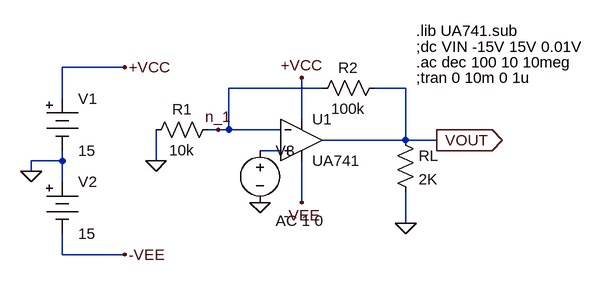
[diagram p0: schematic UA741_noninvert.asc]
UA741_noninvert.asc, the LTspice schematic file:
Version 4
SHEET 1 880 680
WIRE -96 32 -192 32
WIRE 208 64 64 64
WIRE 336 64 288 64
WIRE -192 80 -192 32
WIRE 176 112 176 48
WIRE 48 128 32 128
WIRE 64 128 64 64
WIRE 64 128 48 128
WIRE 144 128 64 128
WIRE 336 144 336 64
WIRE 336 144 208 144
WIRE 384 144 336 144
WIRE 144 160 112 160
WIRE -192 176 -192 160
WIRE -192 176 -240 176
WIRE -48 176 -48 128
WIRE -240 192 -240 176
WIRE -192 208 -192 176
WIRE 176 240 176 176
WIRE 336 272 336 224
WIRE -192 320 -192 288
WIRE -96 320 -192 320
FLAG -240 192 0
FLAG 336 272 0
FLAG -96 32 +VCC
FLAG 176 48 +VCC
FLAG -96 320 -VEE
FLAG 176 240 -VEE
FLAG 384 144 VOUT
IOPIN 384 144 Out
FLAG 48 128 n_1
FLAG -48 176 0
FLAG 112 240 0
SYMBOL Opamps\\opamp2 176 80 R0
SYMATTR InstName U1
SYMATTR Value UA741
SYMBOL res 320 128 R0
SYMATTR InstName RL
SYMATTR Value 2K
SYMBOL Misc\\battery -192 64 R0
WINDOW 123 0 0 Left 2
WINDOW 39 0 0 Left 2
SYMATTR InstName V1
SYMATTR Value 15
SYMBOL Misc\\battery -192 192 R0
WINDOW 123 0 0 Left 2
WINDOW 39 0 0 Left 2
SYMATTR InstName V2
SYMATTR Value 15
SYMBOL res 48 112 R90
WINDOW 0 0 56 VBottom 2
WINDOW 3 32 56 VTop 2
SYMATTR InstName R1
SYMATTR Value 10k
SYMBOL res 304 48 R90
WINDOW 0 0 56 VBottom 2
WINDOW 3 32 56 VTop 2
SYMATTR InstName R2
SYMATTR Value 100k
SYMBOL voltage 112 144 R0
WINDOW 123 24 124 Left 2
WINDOW 39 0 0 Left 2
SYMATTR InstName V3
SYMATTR Value ""
SYMATTR Value2 AC 1 0
TEXT 352 -24 Left 2 !.lib UA741.sub
TEXT 352 0 Left 2 !;dc VIN -15V 15V 0.01V
TEXT 352 24 Left 2 !.ac dec 100 10 10meg
TEXT 352 48 Left 2 !;tran 0 10m 0 1u

The netlist it stands for:
* UA741_noninvert.asc
XU1 N001 n_1 +VCC -VEE VOUT UA741  ; pins In+ In- V+ V- OUT
RL VOUT 0 2K
V1 +VCC 0 15
V2 0 -VEE 15
R1 n_1 0 10k
R2 VOUT n_1 100k
V3 N001 0 AC 1 0
.lib UA741.sub
;dc VIN -15V 15V 0.01V
.ac dec 100 10 10meg
;tran 0 10m 0 1u
.backanno
.end

* Results of the author's LTspice run, read from the files saved beside the schematic
* Operating Point, zero values left out:
*   V(vout) = 8.098 mV
*   V(-vee) = -15 V
*   V(+vcc) = 15 V
*   V(n_1) = 11.14 µV
*   I(R2) = 80.87 nA
*   I(R1) = 1.114 nA
*   I(Rl) = 4.049 µA
*   I(V3) = -79.74 nA
*   I(V2) = -1.667 mA
*   I(V1) = -1.667 mA
*   Ix(u1:1) = 79.74 nA
*   Ix(u1:2) = 79.76 nA
*   Ix(u1:3) = 1.667 mA
*   Ix(u1:4) = -1.667 mA
*   Ix(u1:5) = -4.13 µA